# Altium schematic sheet 3V3 LDO Regulator.SchDoc: 3V3 LDO Regulator
size A4
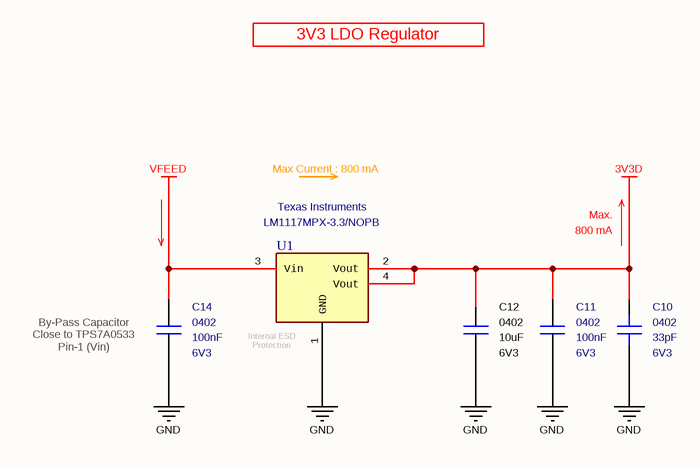
[diagram p0: 3V3 LDO Regulator.SchDoc]

## Parts
C10  value 33pF  Case: 0402  Voltage: 6V3  [CAPACITOR_0402]  (hidden comment: Multilayer Ceramic Capacitor)
C11  value 100nF  Case: 0402  Voltage: 6V3  [CAPACITOR_0402]  (hidden comment: Multilayer Ceramic Capacitor)
C12  value 10uF  Case: 0402  Voltage: 6V3  [CAPACITOR_0402]  (hidden comment: Multilayer Ceramic Capacitor)
C14  value 100nF  Case: 0402  Voltage: 6V3  [CAPACITOR_0402]  (hidden comment: Multilayer Ceramic Capacitor)
U1  Manufacturer Part Number: LM1117MPX-3.3/NOPB  Manufacturer Name: Texas Instruments  [SOT-223-4]  (hidden comment: LDO Voltage Regulator)

## Nets
3V3D: C10.1 C11.1 C12.2 U1.2(Vout) U1.4(Vout)
GND: C10.2 C11.2 C12.1 C14.2 U1.1(GND)
VFEED: C14.1 U1.3(Vin)

## Notes on the sheet
- 3V3 LDO Regulator
- Max Current : 800 mA
- 800 mA
- Max.
- (near C14) By-Pass Capacitor
  Close to TPS7A0533
  Pin-1 (Vin)
- (near U1) Internal ESD Protection
- Title
- Size:
- Date:
- A4
- Number:
- Time:
- Revision:
- Sheet
- of
- File:

## Library data of the parts
C10 = Capacitor - 33pF [0402-6V3]: Capacitor - 33pF [0402] (Ceramic); Manufacturer_Name: Kemet; Manufacturer_Part_Number: C0402C330J9RACAUTO; Dielectric: X7R; Tolerance: 10%; Height: 0.5mm; Mouser_Part_Number: 80-C0402C330J9RAUTO; Maximum Operating Temperature: +125; Minimum Operating Temperature: -55; ROHS: Yes; ComponentLink1Description: DataSheet; ComponentLink1URL: https://api.kemet.com/component-edge/download/datasheet/C0402C330J9RACAUTO.pdf; ComponentLink2Description: Mouser; ComponentLink2URL: https://www.mouser.com/Search/Refine.aspx?Keyword=80-C0402C330J9RAUTO; Supplier 1: Mouser; Supplier Part Number 1: 80-C0402C330J9RAUTO
C11 C14 = Capacitor - 100nF [0402-6V3]: Capacitor - 100nF [0402-6V3] (Ceramic); Manufacturer_Name: AVX; Manufacturer_Part_Number: 04026D104KAT4A; Dielectric: X5R; Tolerance: %10; Height: 0.25mm; Mouser_Part_Number: 581-04026D104KAT4A; ComponentLink1Description: Mouser; ComponentLink1URL: https://www.mouser.com.tr/ProductDetail/AVX/04026D104KAT4A?qs=sGAEpiMZZMs0AnBnWHyRQPg4iYkCw7IMED%2F4kpqgf7w%3D; ComponentLink2Description: DataSheet; ComponentLink2URL: https://www.mouser.com.tr/datasheet/2/40/cx5r-776519.pdf; ROHS: Yes; Maximum Operating Temperature: +85; Minimum Operating Temperature: -55; Supplier 1: Avnet; Supplier Part Number 1: 04026D104KAT4A
C12 = Capacitor - 10uF [0402-6V3]: Capacitor - 10uF [0402] (Ceramic); Manufacturer Name: Kemet; Manufacturer Part Number: C0402C106M9PACTU; Dielectric: X5R; Tolerance: 20%; Height: 0.5mm; Mouser Part Number: 80-C0402C106M9P; Maximum Operating Temperature: +85; Minimum Operating Temperature: -55; RoHS: Yes; ComponentLink1Description: DataSheet; ComponentLink1URL: https://www.mouser.com.tr/datasheet/2/212/KEM_C1006_X5R_SMD-1103249.pdf; ComponentLink2Description: Mouser; ComponentLink2URL: https://www.mouser.com.tr/ProductDetail/KEMET/C0402C106M9PACTU?qs=sGAEpiMZZMs0AnBnWHyRQE3yiXa%2FuseC7%252BLTT67ezUCLPvFYe0E%252BJg%3D%3D; Supplier 1: Avnet; Supplier 2: Mouser; Supplier 3: Arrow; Supplier 4: Farnell; Supplier 5: Newark; Supplier 6: Farnell; Supplier 7: Digi-Key; Supplier 8: Newark; Supplier Part Number 1: C0402C106M9PACTU; Supplier Part Number 2: 80-C0402C106M9P; Supplier Part Number 3: C0402C106M9PACTU; Supplier Part Number 4: 2507061; Supplier Part Number 5: 75Y0593; Supplier Part Number 6: 2750752; Supplier Part Number 7: 399-13069-1-ND; Supplier Part Number 8: 29AC4166
U1 = IC - LM1117MPX-3.3/NOPB: LDO Voltage Regulators 800MA LDO LINEAR REG; Dropout Voltage: 1.2V; Height: 1.8mm; ComponentLink1Description: DataSheet; ComponentLink1URL: http://www.ti.com/general/docs/suppproductinfo.tsp?distId=26&gotoUrl=http%3A%2F%2Fwww.ti.com%2Flit%2Fds%2Fsymlink%2Flm1117.pdf; ComponentLink2Description: Mouser; ComponentLink2URL: https://www.mouser.com.tr/ProductDetail/Texas-Instruments/LM1117MPX-33-NOPB?qs=sGAEpiMZZMsGz1a6aV8DcCERHZHPu4lvuMKECiC7JXI%3D; Case: SOT-223-4; Maximum Operating Temperature: +125; Output Current: 800mA; Minimum Operating Temperature: -40; Mouser Part Number: 926-LM1117MPX3.3NOPB; Supplier 1: Arrow Electronics; Supplier 2: Mouser; Supplier 3: Digi-Key; Supplier 4: Digi-Key; Supplier 5: Digi-Key; Supplier 6: Farnell; Supplier 7: Farnell; Supplier 8: Farnell; Supplier 9: Newark; Supplier 10: Newark; Supplier 11: Newark; Supplier 12: RSComponents; Supplier Part Number 1: LM1117MPX-3.3/NOPB; Supplier Part Number 2: 926-LM1117MPX3.3NOPB; Supplier Part Number 3: LM1117MPX-3.3/NOPBCT-ND; Supplier Part Number 4: LM1117MPX-3.3/NOPBDKR-ND; Supplier Part Number 5: LM1117MPX-3.3/NOPBTR-ND; Supplier Part Number 6: 3122024; Supplier Part Number 7: 3116243; Supplier Part Number 8: 2148396; Supplier Part Number 9: 33AH4053; Supplier Part Number 10: 33AH4054; Supplier Part Number 11: 41K3476; Supplier Part Number 12: 2088522